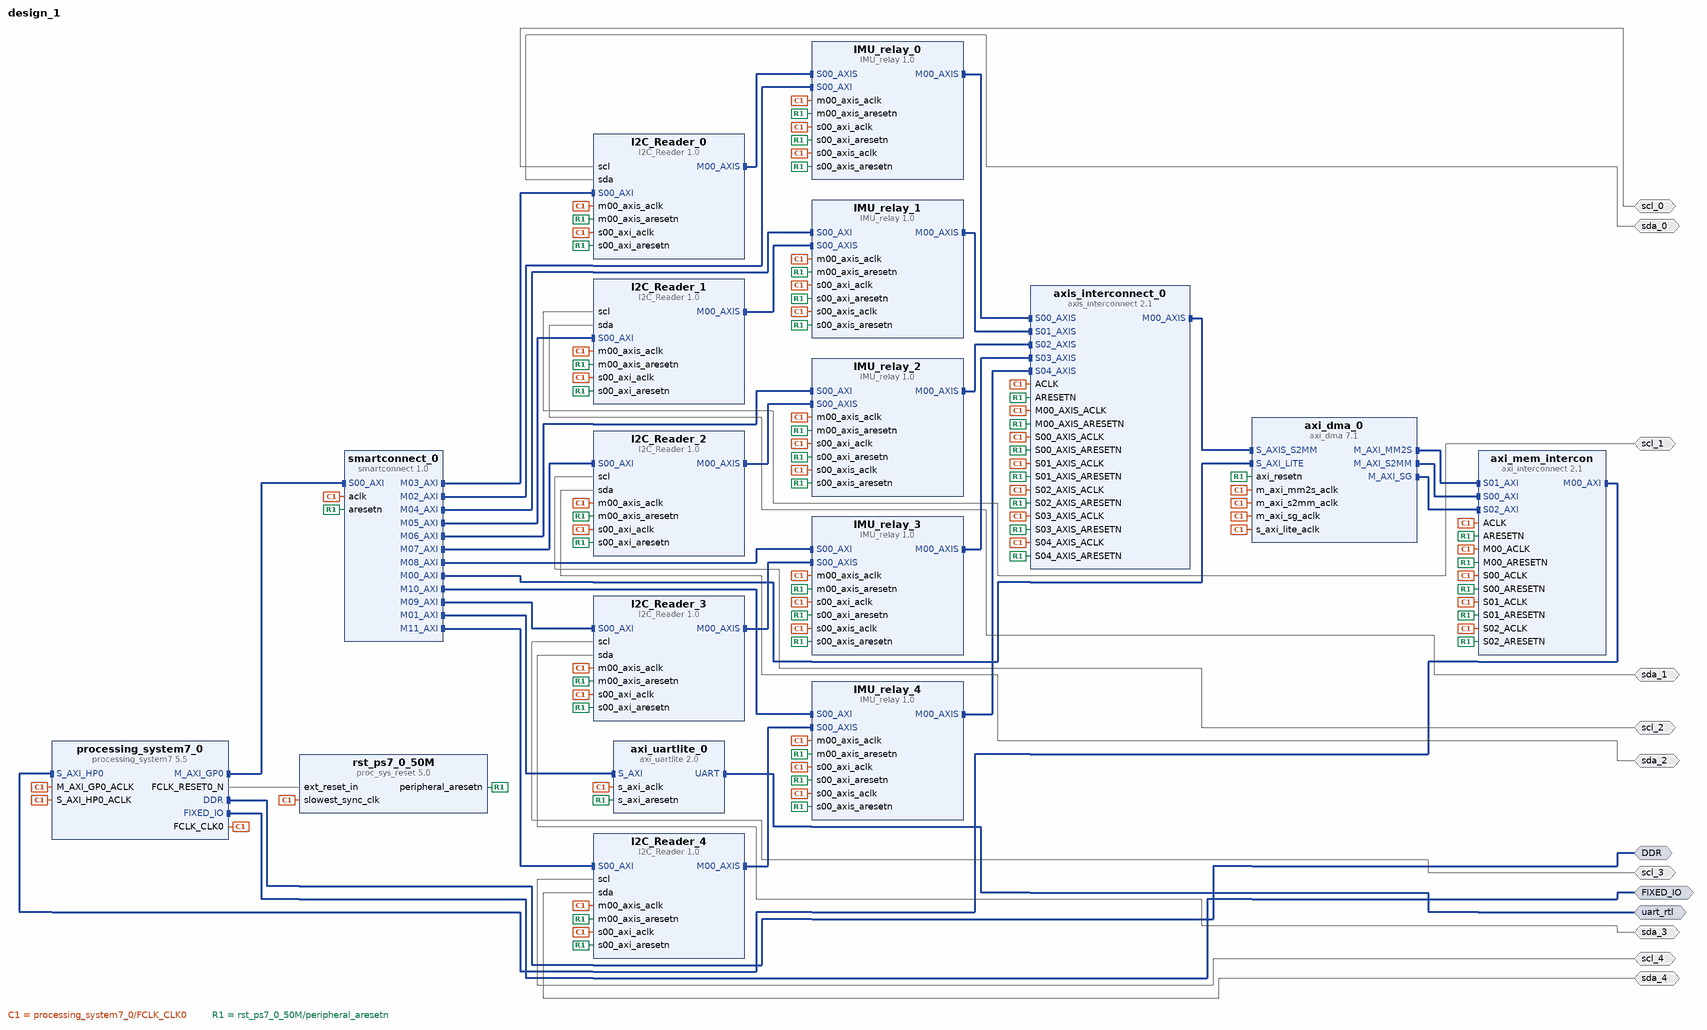
[diagram p0: block diagram of the top level]
# Vivado block design design_1, xc7z020clg400-1, Vivado 2025.1
create_bd_design design_1

create_bd_intf_port -mode Master -vlnv xilinx.com:interface:ddrx_rtl:1.0 DDR
create_bd_intf_port -mode Master -vlnv xilinx.com:display_processing_system7:fixedio_rtl:1.0 FIXED_IO
create_bd_intf_port -mode Master -vlnv xilinx.com:interface:uart_rtl:1.0 uart_rtl
create_bd_port -dir IO scl_0
create_bd_port -dir IO sda_0
create_bd_port -dir IO scl_1
create_bd_port -dir IO sda_1
create_bd_port -dir IO scl_2
create_bd_port -dir IO sda_2
create_bd_port -dir IO scl_3
create_bd_port -dir IO sda_3
create_bd_port -dir IO scl_4
create_bd_port -dir IO sda_4

create_bd_cell -type ip -vlnv xilinx.com:ip:processing_system7:5.5 processing_system7_0
set_property -dict [list \
  CONFIG.PCW_APU_PERIPHERAL_FREQMHZ 667 \
  CONFIG.PCW_ENET0_ENET0_IO {MIO 16 .. 27} \
  CONFIG.PCW_ENET0_GRP_MDIO_ENABLE 1 \
  CONFIG.PCW_ENET0_GRP_MDIO_IO {MIO 52 .. 53} \
  CONFIG.PCW_ENET0_PERIPHERAL_ENABLE 1 \
  CONFIG.PCW_ENET0_RESET_ENABLE 0 \
  CONFIG.PCW_ENET_RESET_ENABLE 1 \
  CONFIG.PCW_ENET_RESET_SELECT {Share reset pin} \
  CONFIG.PCW_GPIO_MIO_GPIO_ENABLE 1 \
  CONFIG.PCW_GPIO_MIO_GPIO_IO MIO \
  CONFIG.PCW_I2C_RESET_ENABLE 1 \
  CONFIG.PCW_PRESET_BANK1_VOLTAGE {LVCMOS 1.8V} \
  CONFIG.PCW_QSPI_GRP_FBCLK_ENABLE 1 \
  CONFIG.PCW_QSPI_GRP_FBCLK_IO {MIO 8} \
  CONFIG.PCW_QSPI_GRP_SINGLE_SS_ENABLE 1 \
  CONFIG.PCW_QSPI_GRP_SINGLE_SS_IO {MIO 1 .. 6} \
  CONFIG.PCW_QSPI_PERIPHERAL_ENABLE 1 \
  CONFIG.PCW_QSPI_QSPI_IO {MIO 1 .. 6} \
  CONFIG.PCW_SD0_GRP_CD_ENABLE 1 \
  CONFIG.PCW_SD0_GRP_CD_IO {MIO 47} \
  CONFIG.PCW_SD0_GRP_WP_ENABLE 0 \
  CONFIG.PCW_SD0_PERIPHERAL_ENABLE 1 \
  CONFIG.PCW_SD0_SD0_IO {MIO 40 .. 45} \
  CONFIG.PCW_SDIO_PERIPHERAL_FREQMHZ 50 \
  CONFIG.PCW_SINGLE_QSPI_DATA_MODE x4 \
  CONFIG.PCW_UART1_PERIPHERAL_ENABLE 1 \
  CONFIG.PCW_UART1_UART1_IO {MIO 48 .. 49} \
  CONFIG.PCW_UART_PERIPHERAL_FREQMHZ 100 \
  CONFIG.PCW_UIPARAM_DDR_FREQ_MHZ 533.333333 \
  CONFIG.PCW_UIPARAM_DDR_MEMORY_TYPE {DDR 3 (Low Voltage)} \
  CONFIG.PCW_UIPARAM_DDR_PARTNO {MT41K256M16 RE-125} \
  CONFIG.PCW_USB0_PERIPHERAL_ENABLE 1 \
  CONFIG.PCW_USB0_RESET_ENABLE 1 \
  CONFIG.PCW_USB0_RESET_IO {MIO 46} \
  CONFIG.PCW_USB0_USB0_IO {MIO 28 .. 39} \
  CONFIG.PCW_USB_RESET_ENABLE 1 \
  CONFIG.PCW_USB_RESET_SELECT {Share reset pin} \
  CONFIG.PCW_USE_S_AXI_HP0 1 \
] [get_bd_cells processing_system7_0]
# 297 more settings of processing_system7_0 are not shown: defaults, MIO pin electricals, DDR timing, and values the tool derives
create_bd_cell -type ip -vlnv xilinx.com:ip:smartconnect:1.0 smartconnect_0
set_property -dict {CONFIG.NUM_MI 12 CONFIG.NUM_SI 1} [get_bd_cells smartconnect_0]
create_bd_cell -type ip -vlnv xilinx.com:ip:proc_sys_reset:5.0 rst_ps7_0_50M
create_bd_cell -type ip -vlnv xilinx.com:ip:axi_uartlite:2.0 axi_uartlite_0
create_bd_cell -type ip -vlnv xilinx.com:user:I2C_Reader:1.0 I2C_Reader_0
create_bd_cell -type ip -vlnv xilinx.com:user:IMU_relay:1.0 IMU_relay_0
create_bd_cell -type ip -vlnv xilinx.com:ip:axis_interconnect:2.1 axis_interconnect_0
set_property -dict {CONFIG.NUM_MI 1 CONFIG.NUM_SI 5} [get_bd_cells axis_interconnect_0]
create_bd_cell -type ip -vlnv xilinx.com:user:IMU_relay:1.0 IMU_relay_1
create_bd_cell -type ip -vlnv xilinx.com:user:I2C_Reader:1.0 I2C_Reader_1
create_bd_cell -type ip -vlnv xilinx.com:user:IMU_relay:1.0 IMU_relay_2
create_bd_cell -type ip -vlnv xilinx.com:user:I2C_Reader:1.0 I2C_Reader_2
create_bd_cell -type ip -vlnv xilinx.com:user:I2C_Reader:1.0 I2C_Reader_3
create_bd_cell -type ip -vlnv xilinx.com:user:IMU_relay:1.0 IMU_relay_3
create_bd_cell -type ip -vlnv xilinx.com:user:I2C_Reader:1.0 I2C_Reader_4
create_bd_cell -type ip -vlnv xilinx.com:user:IMU_relay:1.0 IMU_relay_4
create_bd_cell -type ip -vlnv xilinx.com:ip:axi_dma:7.1 axi_dma_0
create_bd_cell -type ip -vlnv xilinx.com:ip:axi_interconnect:2.1 axi_mem_intercon
set_property -dict {CONFIG.NUM_MI 1 CONFIG.NUM_SI 3} [get_bd_cells axi_mem_intercon]

# ---- connections ----

connect_bd_intf_net [get_bd_intf_pins I2C_Reader_0/M00_AXIS] [get_bd_intf_pins IMU_relay_0/S00_AXIS]
connect_bd_intf_net [get_bd_intf_pins I2C_Reader_1/M00_AXIS] [get_bd_intf_pins IMU_relay_1/S00_AXIS]
connect_bd_intf_net [get_bd_intf_pins I2C_Reader_2/M00_AXIS] [get_bd_intf_pins IMU_relay_2/S00_AXIS]
connect_bd_intf_net [get_bd_intf_pins I2C_Reader_3/M00_AXIS] [get_bd_intf_pins IMU_relay_3/S00_AXIS]
connect_bd_intf_net [get_bd_intf_pins I2C_Reader_4/M00_AXIS] [get_bd_intf_pins IMU_relay_4/S00_AXIS]
connect_bd_intf_net [get_bd_intf_pins IMU_relay_0/M00_AXIS] [get_bd_intf_pins axis_interconnect_0/S00_AXIS]
connect_bd_intf_net [get_bd_intf_pins IMU_relay_1/M00_AXIS] [get_bd_intf_pins axis_interconnect_0/S01_AXIS]
connect_bd_intf_net [get_bd_intf_pins IMU_relay_2/M00_AXIS] [get_bd_intf_pins axis_interconnect_0/S02_AXIS]
connect_bd_intf_net [get_bd_intf_pins IMU_relay_3/M00_AXIS] [get_bd_intf_pins axis_interconnect_0/S03_AXIS]
connect_bd_intf_net [get_bd_intf_pins IMU_relay_4/M00_AXIS] [get_bd_intf_pins axis_interconnect_0/S04_AXIS]
connect_bd_intf_net [get_bd_intf_pins axi_dma_0/M_AXI_MM2S] [get_bd_intf_pins axi_mem_intercon/S01_AXI]
connect_bd_intf_net [get_bd_intf_pins axi_dma_0/M_AXI_S2MM] [get_bd_intf_pins axi_mem_intercon/S00_AXI]
connect_bd_intf_net [get_bd_intf_pins axi_dma_0/M_AXI_SG] [get_bd_intf_pins axi_mem_intercon/S02_AXI]
connect_bd_intf_net [get_bd_intf_pins axi_mem_intercon/M00_AXI] [get_bd_intf_pins processing_system7_0/S_AXI_HP0]
connect_bd_intf_net [get_bd_intf_ports uart_rtl] [get_bd_intf_pins axi_uartlite_0/UART]
connect_bd_intf_net [get_bd_intf_pins axi_dma_0/S_AXIS_S2MM] [get_bd_intf_pins axis_interconnect_0/M00_AXIS]
connect_bd_intf_net [get_bd_intf_ports DDR] [get_bd_intf_pins processing_system7_0/DDR]
connect_bd_intf_net [get_bd_intf_ports FIXED_IO] [get_bd_intf_pins processing_system7_0/FIXED_IO]
connect_bd_intf_net [get_bd_intf_pins processing_system7_0/M_AXI_GP0] [get_bd_intf_pins smartconnect_0/S00_AXI]
connect_bd_intf_net [get_bd_intf_pins smartconnect_0/M00_AXI] [get_bd_intf_pins axi_dma_0/S_AXI_LITE]
connect_bd_intf_net [get_bd_intf_pins smartconnect_0/M01_AXI] [get_bd_intf_pins axi_uartlite_0/S_AXI]
connect_bd_intf_net [get_bd_intf_pins smartconnect_0/M02_AXI] [get_bd_intf_pins IMU_relay_0/S00_AXI]
connect_bd_intf_net [get_bd_intf_pins smartconnect_0/M03_AXI] [get_bd_intf_pins I2C_Reader_0/S00_AXI]
connect_bd_intf_net [get_bd_intf_pins smartconnect_0/M04_AXI] [get_bd_intf_pins IMU_relay_1/S00_AXI]
connect_bd_intf_net [get_bd_intf_pins smartconnect_0/M05_AXI] [get_bd_intf_pins I2C_Reader_1/S00_AXI]
connect_bd_intf_net [get_bd_intf_pins smartconnect_0/M06_AXI] [get_bd_intf_pins IMU_relay_2/S00_AXI]
connect_bd_intf_net [get_bd_intf_pins smartconnect_0/M07_AXI] [get_bd_intf_pins I2C_Reader_2/S00_AXI]
connect_bd_intf_net [get_bd_intf_pins smartconnect_0/M08_AXI] [get_bd_intf_pins IMU_relay_3/S00_AXI]
connect_bd_intf_net [get_bd_intf_pins smartconnect_0/M09_AXI] [get_bd_intf_pins I2C_Reader_3/S00_AXI]
connect_bd_intf_net [get_bd_intf_pins smartconnect_0/M10_AXI] [get_bd_intf_pins IMU_relay_4/S00_AXI]
connect_bd_intf_net [get_bd_intf_pins smartconnect_0/M11_AXI] [get_bd_intf_pins I2C_Reader_4/S00_AXI]
connect_bd_net [get_bd_ports scl_0] [get_bd_pins I2C_Reader_0/scl]
connect_bd_net [get_bd_ports sda_0] [get_bd_pins I2C_Reader_0/sda]
connect_bd_net [get_bd_ports scl_1] [get_bd_pins I2C_Reader_1/scl]
connect_bd_net [get_bd_ports sda_1] [get_bd_pins I2C_Reader_1/sda]
connect_bd_net [get_bd_ports scl_2] [get_bd_pins I2C_Reader_2/scl]
connect_bd_net [get_bd_ports sda_2] [get_bd_pins I2C_Reader_2/sda]
connect_bd_net [get_bd_ports scl_3] [get_bd_pins I2C_Reader_3/scl]
connect_bd_net [get_bd_ports sda_3] [get_bd_pins I2C_Reader_3/sda]
connect_bd_net [get_bd_ports scl_4] [get_bd_pins I2C_Reader_4/scl]
connect_bd_net [get_bd_ports sda_4] [get_bd_pins I2C_Reader_4/sda]
connect_bd_net [get_bd_pins processing_system7_0/FCLK_CLK0] \
  [get_bd_pins processing_system7_0/M_AXI_GP0_ACLK] [get_bd_pins smartconnect_0/aclk] \
  [get_bd_pins rst_ps7_0_50M/slowest_sync_clk] [get_bd_pins axi_uartlite_0/s_axi_aclk] [get_bd_pins axis_interconnect_0/ACLK] \
  [get_bd_pins axis_interconnect_0/S00_AXIS_ACLK] [get_bd_pins axis_interconnect_0/M00_AXIS_ACLK] \
  [get_bd_pins axis_interconnect_0/S01_AXIS_ACLK] [get_bd_pins axis_interconnect_0/S02_AXIS_ACLK] \
  [get_bd_pins axis_interconnect_0/S03_AXIS_ACLK] [get_bd_pins IMU_relay_0/m00_axis_aclk] \
  [get_bd_pins IMU_relay_0/s00_axi_aclk] [get_bd_pins IMU_relay_0/s00_axis_aclk] [get_bd_pins IMU_relay_1/m00_axis_aclk] \
  [get_bd_pins IMU_relay_1/s00_axi_aclk] [get_bd_pins IMU_relay_1/s00_axis_aclk] [get_bd_pins IMU_relay_2/m00_axis_aclk] \
  [get_bd_pins IMU_relay_2/s00_axi_aclk] [get_bd_pins IMU_relay_2/s00_axis_aclk] [get_bd_pins IMU_relay_3/m00_axis_aclk] \
  [get_bd_pins IMU_relay_3/s00_axi_aclk] [get_bd_pins IMU_relay_3/s00_axis_aclk] \
  [get_bd_pins axis_interconnect_0/S04_AXIS_ACLK] [get_bd_pins IMU_relay_4/m00_axis_aclk] \
  [get_bd_pins IMU_relay_4/s00_axis_aclk] [get_bd_pins IMU_relay_4/s00_axi_aclk] [get_bd_pins axi_dma_0/s_axi_lite_aclk] \
  [get_bd_pins axi_dma_0/m_axi_s2mm_aclk] [get_bd_pins axi_dma_0/m_axi_mm2s_aclk] [get_bd_pins axi_mem_intercon/S00_ACLK] \
  [get_bd_pins processing_system7_0/S_AXI_HP0_ACLK] [get_bd_pins axi_mem_intercon/M00_ACLK] \
  [get_bd_pins axi_mem_intercon/ACLK] [get_bd_pins axi_mem_intercon/S01_ACLK] [get_bd_pins axi_dma_0/m_axi_sg_aclk] \
  [get_bd_pins axi_mem_intercon/S02_ACLK] [get_bd_pins I2C_Reader_0/s00_axi_aclk] [get_bd_pins I2C_Reader_0/m00_axis_aclk] \
  [get_bd_pins I2C_Reader_1/s00_axi_aclk] [get_bd_pins I2C_Reader_1/m00_axis_aclk] [get_bd_pins I2C_Reader_2/s00_axi_aclk] \
  [get_bd_pins I2C_Reader_2/m00_axis_aclk] [get_bd_pins I2C_Reader_3/s00_axi_aclk] [get_bd_pins I2C_Reader_3/m00_axis_aclk] \
  [get_bd_pins I2C_Reader_4/s00_axi_aclk] [get_bd_pins I2C_Reader_4/m00_axis_aclk]
connect_bd_net [get_bd_pins processing_system7_0/FCLK_RESET0_N] [get_bd_pins rst_ps7_0_50M/ext_reset_in]
connect_bd_net [get_bd_pins rst_ps7_0_50M/peripheral_aresetn] \
  [get_bd_pins smartconnect_0/aresetn] [get_bd_pins axi_uartlite_0/s_axi_aresetn] [get_bd_pins axis_interconnect_0/ARESETN] \
  [get_bd_pins axis_interconnect_0/S00_AXIS_ARESETN] [get_bd_pins axis_interconnect_0/M00_AXIS_ARESETN] \
  [get_bd_pins axis_interconnect_0/S01_AXIS_ARESETN] [get_bd_pins axis_interconnect_0/S02_AXIS_ARESETN] \
  [get_bd_pins axis_interconnect_0/S03_AXIS_ARESETN] [get_bd_pins IMU_relay_0/m00_axis_aresetn] \
  [get_bd_pins IMU_relay_0/s00_axi_aresetn] [get_bd_pins IMU_relay_0/s00_axis_aresetn] \
  [get_bd_pins IMU_relay_1/m00_axis_aresetn] [get_bd_pins IMU_relay_1/s00_axi_aresetn] \
  [get_bd_pins IMU_relay_1/s00_axis_aresetn] [get_bd_pins IMU_relay_2/m00_axis_aresetn] \
  [get_bd_pins IMU_relay_2/s00_axi_aresetn] [get_bd_pins IMU_relay_2/s00_axis_aresetn] \
  [get_bd_pins IMU_relay_3/m00_axis_aresetn] [get_bd_pins IMU_relay_3/s00_axi_aresetn] \
  [get_bd_pins IMU_relay_3/s00_axis_aresetn] [get_bd_pins axis_interconnect_0/S04_AXIS_ARESETN] \
  [get_bd_pins IMU_relay_4/m00_axis_aresetn] [get_bd_pins IMU_relay_4/s00_axis_aresetn] \
  [get_bd_pins IMU_relay_4/s00_axi_aresetn] [get_bd_pins axi_mem_intercon/S00_ARESETN] \
  [get_bd_pins axi_mem_intercon/M00_ARESETN] [get_bd_pins axi_mem_intercon/ARESETN] \
  [get_bd_pins axi_mem_intercon/S01_ARESETN] [get_bd_pins axi_mem_intercon/S02_ARESETN] \
  [get_bd_pins I2C_Reader_0/s00_axi_aresetn] [get_bd_pins I2C_Reader_0/m00_axis_aresetn] \
  [get_bd_pins I2C_Reader_1/s00_axi_aresetn] [get_bd_pins I2C_Reader_1/m00_axis_aresetn] \
  [get_bd_pins I2C_Reader_2/s00_axi_aresetn] [get_bd_pins I2C_Reader_2/m00_axis_aresetn] \
  [get_bd_pins I2C_Reader_3/s00_axi_aresetn] [get_bd_pins I2C_Reader_3/m00_axis_aresetn] \
  [get_bd_pins I2C_Reader_4/s00_axi_aresetn] [get_bd_pins I2C_Reader_4/m00_axis_aresetn] [get_bd_pins axi_dma_0/axi_resetn]
set_property PFM.AXI_PORT {M_AXI_GP1 {memport "M_AXI_GP" sptag "" memory "" is_range "false"} S_AXI_HP1 {memport "S_AXI_HP" sptag "" memory "" is_range "false"}} [get_bd_cells processing_system7_0]
set_property PFM.CLOCK {FCLK_CLK0 {id "1" is_default "true" proc_sys_reset "/rst_ps7_0_50M" status "fixed" freq_hz "50000000"}} [get_bd_cells processing_system7_0]

# ---- address map ----
assign_bd_address -offset 0x00000000 -range 1G -target_address_space [get_bd_addr_spaces axi_dma_0/Data_MM2S] [get_bd_addr_segs processing_system7_0/S_AXI_HP0/HP0_DDR_LOWOCM]
assign_bd_address -offset 0x00000000 -range 1G -target_address_space [get_bd_addr_spaces axi_dma_0/Data_S2MM] [get_bd_addr_segs processing_system7_0/S_AXI_HP0/HP0_DDR_LOWOCM]
assign_bd_address -offset 0x00000000 -range 1G -target_address_space [get_bd_addr_spaces axi_dma_0/Data_SG] [get_bd_addr_segs processing_system7_0/S_AXI_HP0/HP0_DDR_LOWOCM]
assign_bd_address -offset 0x40400000 -range 64K -target_address_space [get_bd_addr_spaces processing_system7_0/Data] [get_bd_addr_segs axi_dma_0/S_AXI_LITE/Reg]
assign_bd_address -offset 0x42C00000 -range 64K -target_address_space [get_bd_addr_spaces processing_system7_0/Data] [get_bd_addr_segs axi_uartlite_0/S_AXI/Reg]
assign_bd_address -offset 0x43C10000 -range 64K -target_address_space [get_bd_addr_spaces processing_system7_0/Data] [get_bd_addr_segs IMU_relay_0/S00_AXI/S00_AXI_reg]
assign_bd_address -offset 0x43C20000 -range 64K -target_address_space [get_bd_addr_spaces processing_system7_0/Data] [get_bd_addr_segs IMU_relay_1/S00_AXI/S00_AXI_reg]
assign_bd_address -offset 0x43C30000 -range 64K -target_address_space [get_bd_addr_spaces processing_system7_0/Data] [get_bd_addr_segs IMU_relay_2/S00_AXI/S00_AXI_reg]
assign_bd_address -offset 0x43C40000 -range 64K -target_address_space [get_bd_addr_spaces processing_system7_0/Data] [get_bd_addr_segs IMU_relay_3/S00_AXI/S00_AXI_reg]
assign_bd_address -offset 0x43C50000 -range 64K -target_address_space [get_bd_addr_spaces processing_system7_0/Data] [get_bd_addr_segs IMU_relay_4/S00_AXI/S00_AXI_reg]
assign_bd_address -offset 0x43C60000 -range 64K -target_address_space [get_bd_addr_spaces processing_system7_0/Data] [get_bd_addr_segs I2C_Reader_0/S00_AXI/S00_AXI_reg]
assign_bd_address -offset 0x43C70000 -range 64K -target_address_space [get_bd_addr_spaces processing_system7_0/Data] [get_bd_addr_segs I2C_Reader_1/S00_AXI/S00_AXI_reg]
assign_bd_address -offset 0x43C80000 -range 64K -target_address_space [get_bd_addr_spaces processing_system7_0/Data] [get_bd_addr_segs I2C_Reader_2/S00_AXI/S00_AXI_reg]
assign_bd_address -offset 0x43C90000 -range 64K -target_address_space [get_bd_addr_spaces processing_system7_0/Data] [get_bd_addr_segs I2C_Reader_3/S00_AXI/S00_AXI_reg]
assign_bd_address -offset 0x43CA0000 -range 64K -target_address_space [get_bd_addr_spaces processing_system7_0/Data] [get_bd_addr_segs I2C_Reader_4/S00_AXI/S00_AXI_reg]

validate_bd_design
save_bd_design
